# EAGLE design Pcon (EAGLE 7.7.0)
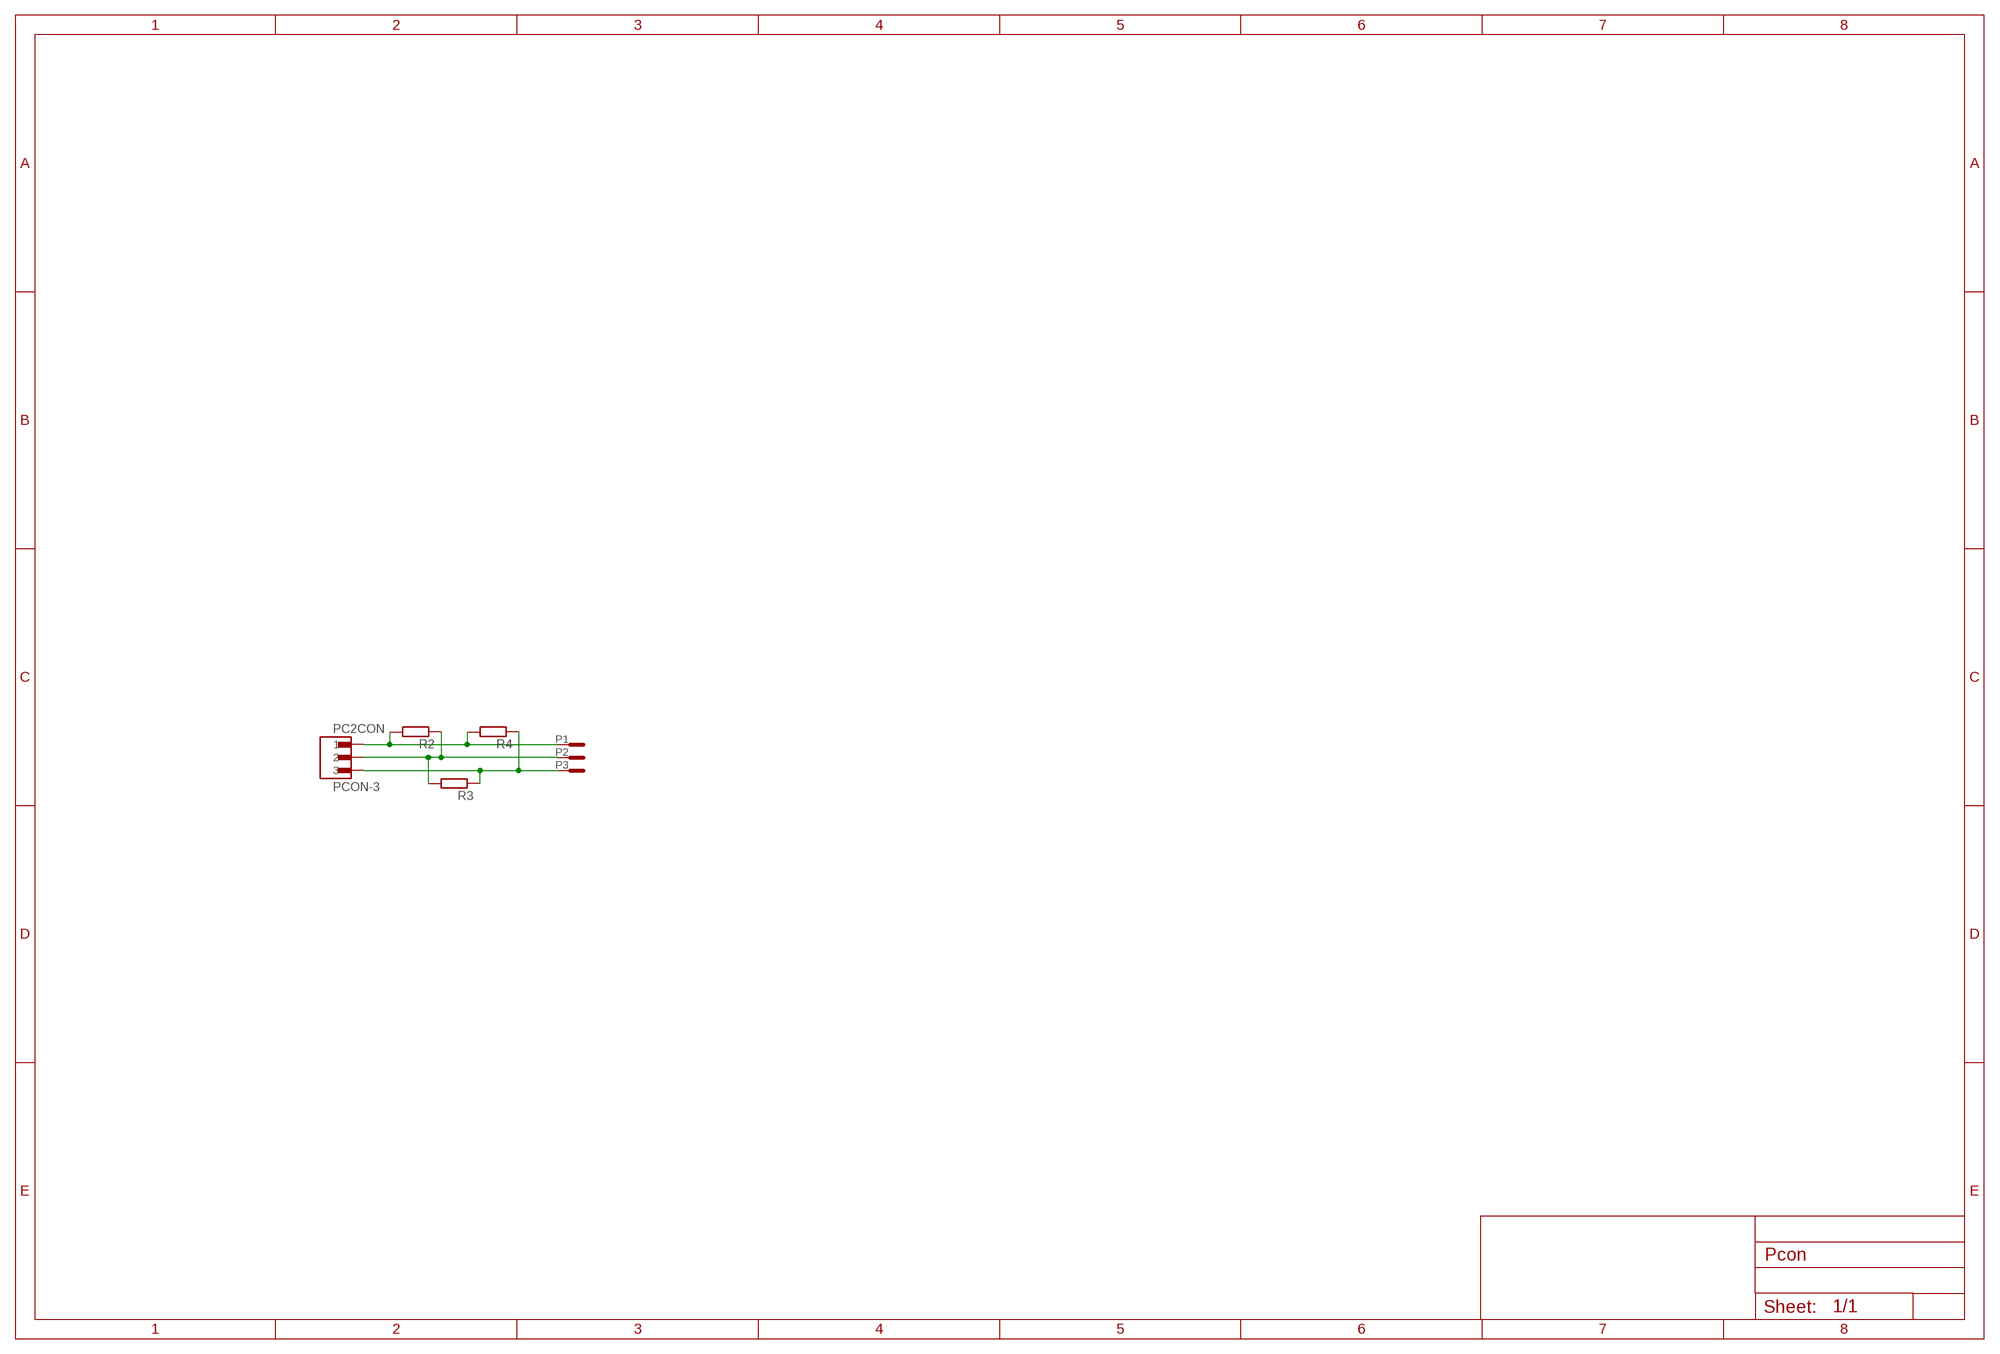
[diagram p0: schematic, sheet 1]

## Parts
PC2  PCON-3  [PCON-3]
R2  R-EU_R0603  [R0603]
R3  R-EU_R0603  [R0603]
R4  R-EU_R0603  [R0603]

## Nets
N$3: PC2.3 PC2.P3(P3:P) R3.1 R4.1
N$4: PC2.2 PC2.P2(P2:P) R2.1 R3.2
N$5: PC2.1 PC2.P1(P1:P) R2.2 R4.2

## Library data of the parts
PC2 = exmachina:PCON-3?
R2-R4 = rcl:R-EU_: RESISTOR, European symbol

## Board
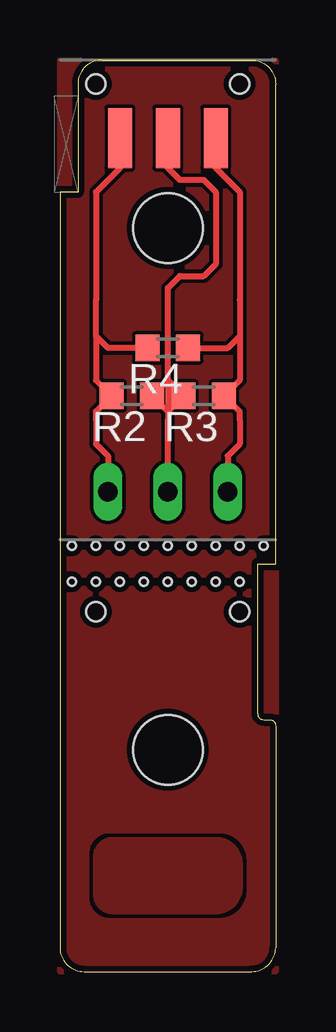
[diagram p1: board, top side]
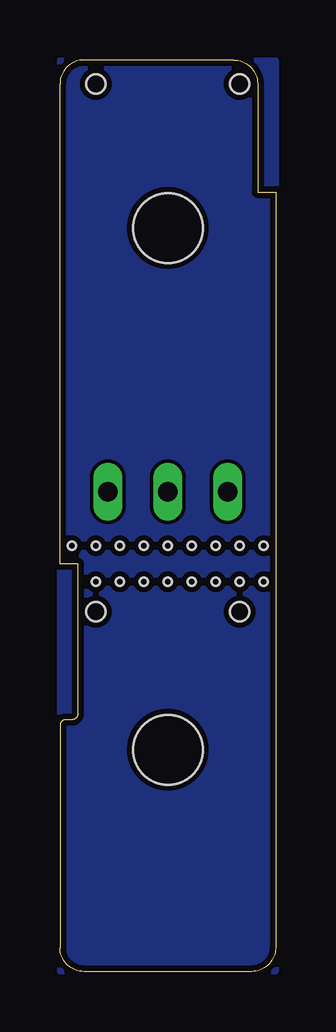
[diagram p2: board, bottom side, seen from below]

Size 9 x 38 mm. Coordinates in mm from the lower left corner, seen from the top.
Outline: 9,17 9,37 arc90 8,38 1.75,38 arc90 0.75,37 0.75,32.5 0,32.5 0,1 arc90 1,0 8,0 arc90 9,1 9,10.25 arc90 8.75,10.5 8.5,10.5 arc-90 8.25,10.75 8.25,17 9,17
Copper layers (1*16): Top 0.018mm / dielectric 1.55mm / Bottom 0.018mm
Design rules "eC_2Layer_PClass6_BaseCopperO18_eCDefault *": minimum track width 0.15mm, minimum drill 0.35mm, track to track 0.15mm, track to pad 0.15mm, pad to pad 0.15mm, via to via 0.15mm, smd to smd 0mil, copper to edge 0.25mm, drill to drill 0.35mm, minimum pad ring 0.175mm, minimum via ring 0.125mm, stop-mask expansion 0mil, vias tented up to drill 0.45mm, thermal gap 0.2mm
Holes 2.9 mm at 4.5,9.25
Holes 0.8 mm at 1.5,15 7.5,15
Holes 0.35 mm at 1.5,17.75 2.5,17.75 3.5,17.75 0.5,17.75 1.5,16.25 2.5,16.25 3.5,16.25 0.5,16.25 5.5,17.75 6.5,17.75 7.5,17.75 4.5,17.75 5.5,16.25 6.5,16.25 7.5,16.25 4.5,16.25 8.5,17.75

### Footprints (pad centres in the part's own frame; a part is rotated, then mirrored left to right if it is on the bottom)
PCON-3 = smd 1 x 2.5: 1 -2,-2.25; 2 0,-2.25; 3 2,-2.25 | drill 0.8 long: P1 -2.5,-17; P2 0,-17; P3 2.5,-17 | hole 0.8: 3,0; -3,0 | hole 2.9: 0,-6
R0603 = smd 1 x 1.1: 1 -0.85,0; 2 0.85,0

### Placement (x,y rotation side)
PC2  4.5,37 0 top
R2  3,24 180 top
R3  6,24 180 top
R4  4.5,26 180 top

### Tracks (layer width: path | path; a pad name or v marks a point on that pad's centre or on a via)
GND
  pour Top (rank 6): 0,0 0,38 9,38 9,0
  pour Bottom (rank 6): 9,0 9,38 0,38 0,0
N$3
  Top 0.254: 7.5,26.5 7.5,24.65 R3.1 7.5,23.35 7.5,23 | R4.1 7,26 7.5,26.5 | 7.5,28 7.5,26.5
N$4
  Top 0.254: 4.5,24.65 R2.1 4.5,23.35 | 4.5,24.65 R3.2 4.5,23.35 | 4.5,23.35 4.5,23 | 4.5,24.65 4.5,23.35 | 4.5,24.65 4.5,28
N$5
  Top 0.254: 1.5,23 1.5,23.35 R2.2 1.5,24.65 1.5,26.5 | R4.2 2,26 1.5,26.5 | 1.5,26.5 1.5,28
N$8
  pour Top: 2.25,5.5 6.5,5.5 arc-90 7.5,4.5 7.5,3.5 arc-90 6.5,2.5 2.25,2.5 arc-90 1.5,3.25 1.5,4.75 arc-90